# Altium schematic sheet main.SchDoc
size A4
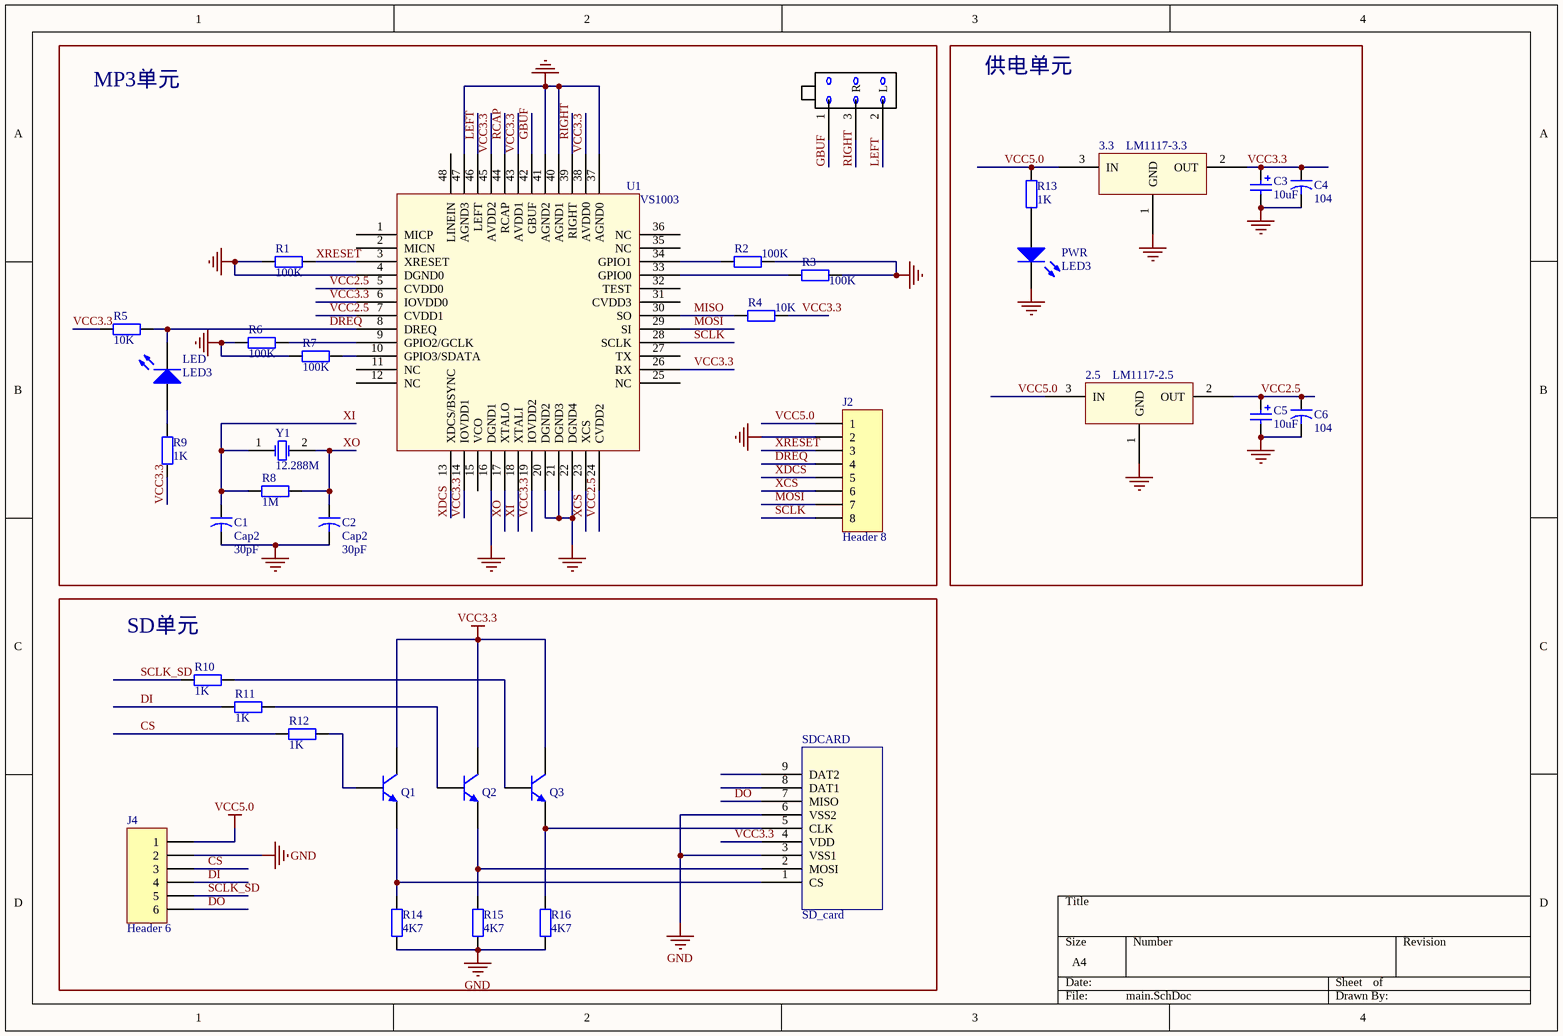
[diagram p0: main.SchDoc]

## Parts
2.5  LM1117-2.5  [SOT223]
3.3  LM1117-3.3  [SOT223]
C1  Cap2  value 30pF  [C0805]
C2  Cap2  value 30pF  [C0805]
C3  value 10uF  [3528]  (hidden comment: Cap Pol3)
C4  value 104  [C0805]  (hidden comment: Cap2)
C5  value 10uF  [3528]  (hidden comment: Cap Pol3)
C6  value 104  [C0805]  (hidden comment: Cap2)
J2  Header 8  [HDR1X8]
J4  Header 6  [HDR1X6]
LED  LED3  [DSO-C2/D5.6]
Phonejack  Phonejack  [3.5mmphonejack]  (value not drawn)
PWR  LED3  [DSO-C2/D5.6]
Q1  8050  [SOT-23]  (value not drawn)
Q2  8050  [SOT-23]  (value not drawn)
Q3  8050  [SOT-23]  (value not drawn)
R1  value 100K  [C0805]  (hidden comment: Res2)
R2  value 100K  [C0805]  (hidden comment: Res2)
R3  value 100K  [C0805]  (hidden comment: Res2)
R4  value 10K  [C0805]  (hidden comment: Res2)
R5  value 10K  [C0805]  (hidden comment: Res2)
R6  value 100K  [C0805]  (hidden comment: Res2)
R7  value 100K  [C0805]  (hidden comment: Res2)
R8  value 1M  [C0805]  (hidden comment: Res2)
R9  value 1K  [C0805]  (hidden comment: Res2)
R10  value 1K  [C0805]  (hidden comment: Res2)
R11  value 1K  [C0805]  (hidden comment: Res2)
R12  value 1K  [C0805]  (hidden comment: Res2)
R13  value 1K  [C0805]  (hidden comment: Res2)
R14  value 4K7  [C0805]  (hidden comment: Res2)
R15  value 4K7  [C0805]  (hidden comment: Res2)
R16  value 4K7  [C0805]  (hidden comment: Res2)
SDCARD  SD_card  [SDCARD]
U1  VS1003  [LQFP-48]
Y1  12.288M  [XTAL]

## Blocks framed on the sheet
MP3单元: C1 C2 J2 LED Phonejack R1-R9 U1 Y1
供电单元: 2.5 3.3 C3-C6 PWR R13
SD单元: J4 Q1-Q3 R10-R12 R14-R16 SDCARD

## Nets
GND: 2.5.1(GND) 3.3.1(GND) C1.2 C2.2 C3.2 C4.2 C5.2 C6.2 J2.2 J4.2 PWR.2(K) R1.1 R2.2 R3.2 R6.1 R7.1 R14.1 R15.1 R16.1 SDCARD.3(VSS1) SDCARD.6(VSS2) U1.4(DGND0) U1.16(DGND1) U1.20(DGND2) U1.21(DGND3) U1.22(DGND4) U1.37(AGND0) U1.40(AGND1) U1.41(AGND2) U1.47(AGND3)
VCC3.3: 3.3.2(OUT) C3.1 C4.1 Q1.3(C) Q2.3(C) Q3.3(C) R4.2 R5.1 R9.1 SDCARD.4(VDD) U1.6(IOVDD0) U1.14(IOVDD1) U1.19(IOVDD2) U1.26(RX) U1.38(AVDD0) U1.43(AVDD1) U1.45(AVDD2)
VCC5.0: 2.5.3(IN) 3.3.3(IN) J2.1 J4.1 R13.1
CS: J4.3 R12.1
DI: J4.4 R11.1
DO: J4.6 SDCARD.7(MISO)
DREQ: J2.4 LED.2(K) R5.2 U1.8(DREQ)
GBUF: Phonejack.1(GBUF) U1.42(GBUF)
LEFT: Phonejack.2(L) U1.46(LEFT)
MISO: R4.1 U1.30(SO)
MOSI: J2.7 U1.29(SI)
RCAP: U1.44(RCAP)
RIGHT: Phonejack.3(R) U1.39(RIGHT)
SCLK: J2.8 U1.28(SCLK)
SCLK_SD: J4.5 R10.1
VCC2.5: 2.5.2(OUT) C5.1 C6.1 U1.5(CVDD0) U1.7(CVDD1) U1.24(CVDD2)
XCS: J2.6 U1.23(XCS)
XDCS: J2.5 U1.13(XDCS/BSYNC)
XI: C1.1 R8.1 U1.18(XTALI) Y1.1(OSC1)
XO: C2.1 R8.2 U1.17(XTALO) Y1.2(OSC2)
XRESET: J2.3 R1.2 U1.3(XRESET)
NetLED_1: LED.1(A) R9.2
NetPWR_1: PWR.1(A) R13.2
NetQ1_1: Q1.1(B) R12.2
NetQ1_2: Q1.2(E) R14.2 SDCARD.1(CS)
NetQ2_1: Q2.1(B) R11.2
NetQ2_2: Q2.2(E) R15.2 SDCARD.2(MOSI)
NetQ3_1: Q3.1(B) R10.2
NetQ3_2: Q3.2(E) R16.2 SDCARD.5(CLK)
NetR2_1: R2.1 U1.34(GPIO1)
NetR3_1: R3.1 U1.33(GPIO0)
NetR6_2: R6.2 U1.9(GPIO2/GCLK)
NetR7_2: R7.2 U1.10(GPIO3/SDATA)

Not connected (* = marked no-connect by the designer): SDCARD 8(DAT1) 9(DAT2); U1 1(MICP) 2(MICN) 11(NC) 12(NC) 15(VCO) 25(NC) 27(TX) 31(CVDD3) 32(TEST) 35(NC) 36(NC) 48(LINEIN)

## Library data of the parts
2.5 = LM1117-3.3
C1 C2 C4 C6 = Cap2: Capacitor; Published: 23-Sep-2002; Publisher: Altium Limited
  C4 C6: PackageReference: CAPR5-4X5
C3 C5 = Cap Pol3: Polarized Capacitor (Surface Mount); Published: 8-Jun-2000; Revision: July-2002: Re-released for DXP Platform.; Publisher: Altium Limited
J2 = Header 8: Header, 8-Pin; Revision: 17-Jul-2002: Re-released for DXP Platform.; Publisher: Altium Limited
J4 = Header 6: Header, 6-Pin; LatestRevisionDate: 17-Jul-2002; LatestRevisionNote: Re-released for DXP Platform.; Publisher: Altium Limited
LED PWR = LED3: Typical BLUE SiC LED; Published: 8-Jun-2000; LatestRevisionDate: 17-Dec-2003; LatestRevisionNote: PCB Footprint replaced.; DatasheetVersion: 16-Apr-2002; PackageVersion: 16-Apr-2002; PackageReference: 3.5X2.8X1.9; Publisher: Altium Limited
R1-R16 = Res2: Resistor; Published: 8-Jun-2000; Publisher: Altium Limited
  R1-R9 R13: Revision: July-2002: Re-released for DXP Platform.
  R10-R12 R14-R16: LatestRevisionDate: 17-Jul-2002; LatestRevisionNote: Re-released for DXP Platform.; PackageReference: AXIAL-0.4
Y1 = XTAL: Crystal Oscillator; Published: 8-Jun-2000; Revision: July-2002: Re-released for DXP Platform.; Publisher: Altium Limited